# Altium schematic sheet Sheet 3 - Alims.SchDoc
size A4
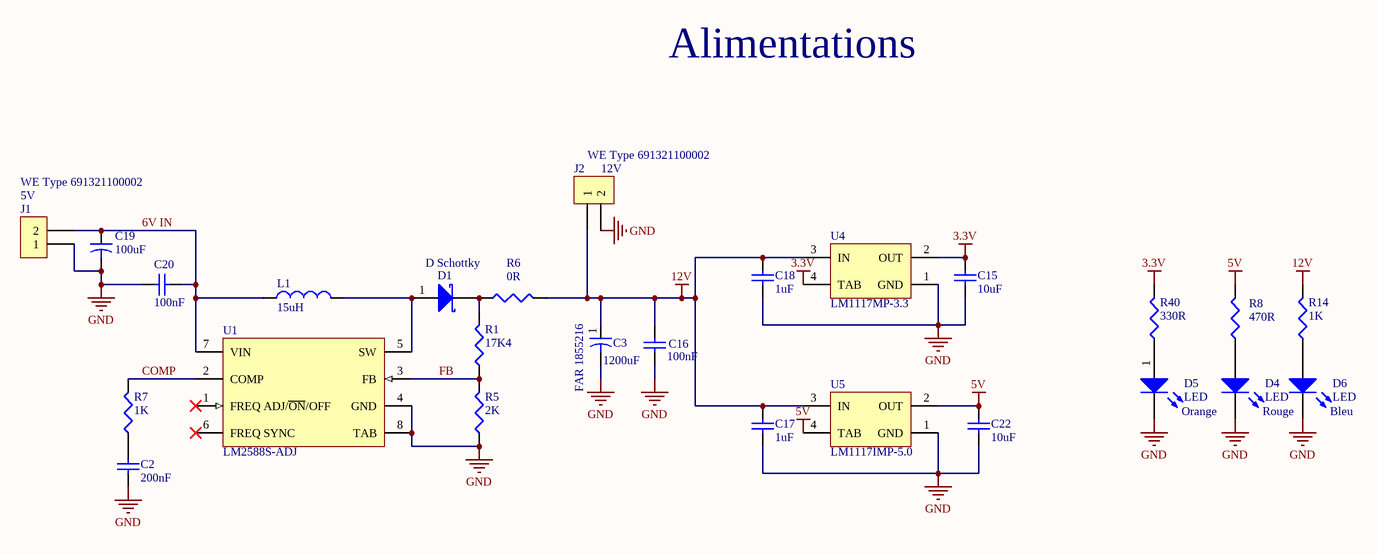
[diagram p0: Sheet 3 - Alims.SchDoc]

## Parts
C2  200nF  [C0805]
C3  1200uF  référence commande: FAR 1855216  [CAPA_D10_E5]
C15  10uF  [C0805]
C16  100nF  [C0805]
C17  1uF  [C0805]
C18  1uF  [C0805]
C19  100uF  [C1206]
C20  100nF  [C0805]
C22  10uF  [C0805]
D1  D Schottky  [D0805]
D4  LED  value Rouge  [LED 0805]
D5  LED  value Orange  [LED 0805]
D6  LED  value Bleu  [LED 0805]
J1  WE Type 691321100002  value1: 5V  [691321100002]
J2  WE Type 691321100002  value1: 12V  [691321100002]
L1  15uH  [Inductance 4.06 x 4.45]
R1  17K4  [0805]
R5  2K  [0805]
R6  0R  [0805]
R7  1K  [0805]
R8  470R  [0805]
R14  1K  [0805]
R40  330R  [0805]
U1  LM2588S-ADJ  [TS7B_N]
U4  LM1117MP-3.3  [MP04A_N]
U5  LM1117IMP-5.0  [MP04A_N]

## Nets
3.3V: C15.2 R40.2 U4.2(OUT) U4.4(TAB)
5V: C22.2 R8.2 U5.2(OUT) U5.4(TAB)
12V: C3.1 C16.2 C17.2 C18.2 J2.1 R6.2 R14.2 U4.3(IN) U5.3(IN)
GND: C2.1 C3.2 C15.1 C16.1 C17.1 C18.1 C19.2 C20.1 C22.1 D4.2(K) D5.2(K) D6.2(K) J1.2(1) J2.2 R5.1 U1.4(GND) U1.8(TAB) U4.1(GND) U5.1(GND)
6V IN: C19.1 C20.2 J1.1(2) L1.1 U1.7(VIN)
COMP: R7.2 U1.2(COMP)
FB: R1.1 R5.2 U1.3(FB)
NetC2_2: C2.2 R7.1
NetD1_1: D1.1(A) L1.2 U1.5(SW)
NetD1_2: D1.2(K) R1.2 R6.1
NetD4_1: D4.1(A) R8.1
NetD5_1: D5.1(A) R40.1
NetD6_1: D6.1(A) R14.1

Not connected (* = marked no-connect by the designer): U1 1(FREQ_ADJ/~{ON}/OFF)* 6(FREQ_SYNC)*

## Notes on the sheet
- Alimentations

## Library data of the parts
C2 C15-C18 C20 C22 = Cap: Capacitor 0805; Published: 8-Jun-2000; LatestRevisionDate: 17-Jul-2002; LatestRevisionNote: Re-released for DXP Platform.; PackageReference: RAD-0.3; Publisher: Altium Limited
  C2: Value: 200nF
  C15 C22: Value: 10uF
  C16 C20: Value: 100nF
  C17 C18: Value: 1uF
C3 = Cap2: EEUFM1C122L; Published: 23-Sep-2002; PackageReference: CAPR5-4X5; Publisher: Altium Limited; Value: 1200uF; Supplier 1: Farnell; Supplier Part Number 1: 185-5216
C19 = Cap2: Capacitor 1206; Published: 23-Sep-2002; PackageReference: CAPR5-4X5; Publisher: Altium Limited; Value: 100uF; reference farnell: 2211193; Supplier 1: Farnell; Supplier Part Number 1: 221-1193
D1 = D Schottky: Schottky Diode 0805; value: SD0805S040S0R5; Published: 8-Jun-2000; LatestRevisionDate: 17-Jul-2002; LatestRevisionNote: Re-released for DXP Platform.; PackageReference: SMB; Publisher: Altium Limited; Code_JEDEC: DO-214-AA; Supplier 1: Farnell; Supplier Part Number 1: 240-0203
D4-D6 = LED2: Typical RED, GREEN, YELLOW, AMBER GaAs LED 0805; Published: 8-Jun-2000; LatestRevisionDate: 17-Jul-2002; LatestRevisionNote: Re-released for DXP Platform.; PackageVersion: Feb-2002; PackageReference: 3.2X1.6X1.1; Publisher: Altium Limited
J1 J2 = WE-Terminal Blocks Plugable Type 691321100002: WR-TBL Terminal block - serie 3211 - 3.50 mm; Manufacturer: W¨¹rth Elektronik eiSos GmbH; ComponentLink1 Description: Manufacturer; ComponentLink2 Description: Datasheet; NoPins: 2; Created Date: 9 December 2013; ComponentLink1URL: http://www.we-online.com; ComponentLink2URL: http://katalog.we-online.de/em/datasheet/6913211000xx.pdf; Created by: Karrer Zheng; value: 691321100002; Supplier Part Number 1: 3704816
  J1: partNo: 691321100002; Supplier 1: farnell
  J2: Supplier 1: Farnell
L1 = Inductor: SRP4020TA-150M; Code_IEC: 1005; Published: 8-Jun-2000; LatestRevisionDate: 29-May-2009; LatestRevisionNote: IPC-7351 Footprint Added.; PackageReference: 0402-A; Publisher: Altium Limited; PackageDescription: Chip Inductor; Code_JEITA: 0402; Value: 15uH; Supplier 1: farnell; Supplier Part Number 1: 243-4809
R1 R5-R8 R14 R40 = Res3: Resistor 0805; Published: 8-Jun-2000; LatestRevisionDate: 29-May-2009; LatestRevisionNote: IPC-7351 Footprint Added.; PackageReference: J1-0603; Publisher: Altium Limited; PackageDescription: Chip Resistor
  R1: Value: 17K4
  R5: Value: 2k
  R6: Value: 0R
  R7 R14: Value: 1K
  R8: Value: 470R
  R40: Value: 330R
U1 = LM2588S-ADJ: SIMPLE SWITCHER 5A Flyback Regulator with Shutdown; Manufacturer: National Semiconductor; PackageTopMarking: NSUZXYTT*LM2588S*-ADJ P+; PowerWise: N; FirstPublished: 4-Dec-2008; DatasheetVersion: Jul-2005; PackageVersion: revE, Jul-2003; PackageReference: TS7B; Publisher: Altium Limited; PackageDescription: TO-263, Molded, .400 x .390 x .180in Body, 7 Lead, .050in Pitch, Surface Mount; CompType: Switcher; PartNumber: LM2588S-ADJ; RoHS: O; PinCount: 7; DigiKeyPartNumber: LM2588S-ADJ-ND; Code_JEDEC: MO-169-AC; ComponentLink1Description: LM2588 Datasheet; ComponentLink1URL: http://www.national.com/ds/LM/LM2588.pdf; ComponentLink2Description: LM2588 Web Page; ComponentLink2URL: http://www.national.com/pf/LM/LM2588.html; ComponentLink3Description: TS7B Package Page; ComponentLink3URL: http://www.national.com/packaging/folders/ts7b.html; Supplier 1: Farnell; Supplier Part Number 1: 232-3492; Supplier 2: RS; Supplier Part Number 2: 533-3412; value: LM2588S-ADJ
U4 = LM1117MP-3.3: 800mA Low-Dropout Linear Regulator; Manufacturer: National Semiconductor; CompType: LDO IC; PackageTopMarking: XYTT*N05A; PowerWise: N; Published: 4-Dec-2008; DatasheetVersion: Apr-2006; PackageVersion: revB, Apr-2003; PackageReference: MP04A; Publisher: Altium Limited; PackageDescription: Molded SOT-223, 6.50 x 3.56 x 1.6mm Body, 4 Lead, 2.3mm Pitch; PartNumber: LM1117MP-3.3; RoHS: O; PinCount: 4; DigiKeyPartNumber: LM1117MP-3.3CT-ND; Code_JEDEC: TO-261-AA; Code_IPC: SOT223-4; ComponentLink1Description: LM1117 Datasheet; ComponentLink1URL: http://www.national.com/ds/LM/LM1117.pdf; ComponentLink2Description: LM1117 Web Page; ComponentLink2URL: http://www.national.com/pf/LM/LM1117.html; ComponentLink3Description: MP04A Package Page; ComponentLink3URL: http://www.national.com/packaging/folders/mp04a.html; Supplier Part Number 1: 977-8195; Supplier 1: Farnell; value: LM1117MP-3.3
U5 = LM1117IMP-5.0: 800mA Low-Dropout Linear Regulator; Manufacturer: National Semiconductor; CompType: LDO IC; PackageTopMarking: XYTT*N06B; PowerWise: N; Published: 4-Dec-2008; DatasheetVersion: Apr-2006; PackageVersion: revB, Apr-2003; PackageReference: MP04A; Publisher: Altium Limited; PackageDescription: Molded SOT-223, 6.50 x 3.56 x 1.6mm Body, 4 Lead, 2.3mm Pitch; PartNumber: LM1117IMP-5.0; RoHS: O; PinCount: 4; DigiKeyPartNumber: LM1117IMP-5.0CT-ND; Code_JEDEC: TO-261-AA; Code_IPC: SOT223-4; ComponentLink1Description: LM1117 Datasheet; ComponentLink1URL: http://www.national.com/ds/LM/LM1117.pdf; ComponentLink2Description: LM1117 Web Page; ComponentLink2URL: http://www.national.com/pf/LM/LM1117.html; ComponentLink3Description: MP04A Package Page; ComponentLink3URL: http://www.national.com/packaging/folders/mp04a.html; Supplier Part Number 1: 240-0655; Supplier 1: Farnell; value: LM1117IMP-5.0